# Altium schematic sheet schematics.schdoc
size 551 x 460 mm
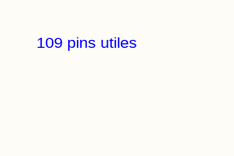
[diagram p0: schematics.schdoc, top left]
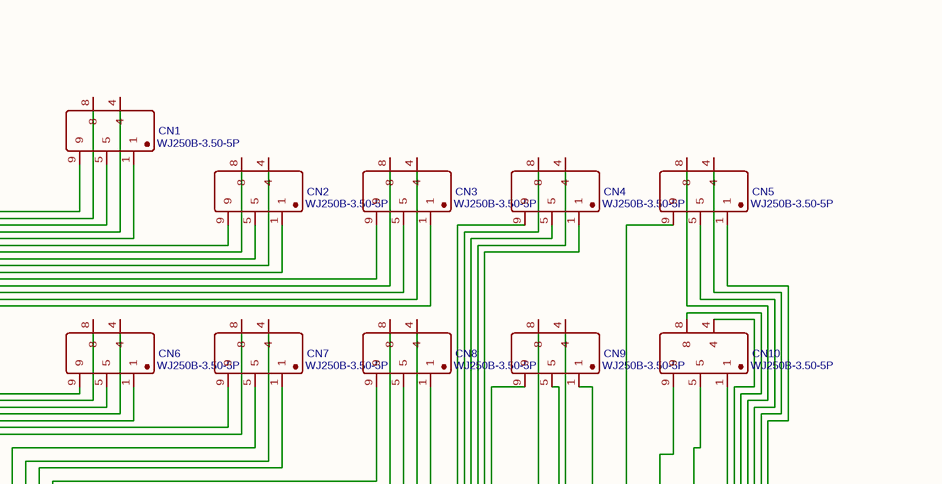
[diagram p1: schematics.schdoc, top right]
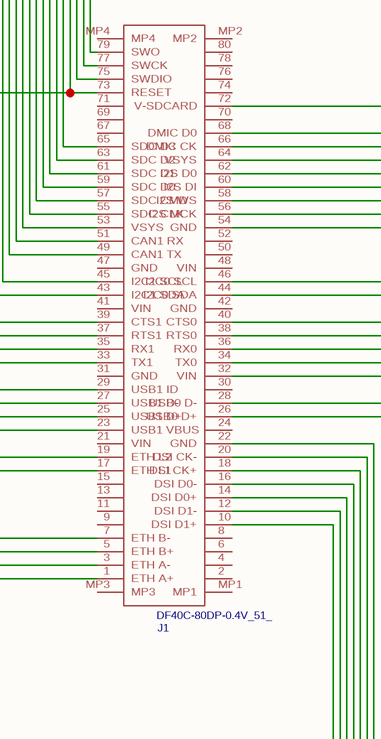
[diagram p2: schematics.schdoc, bottom left]
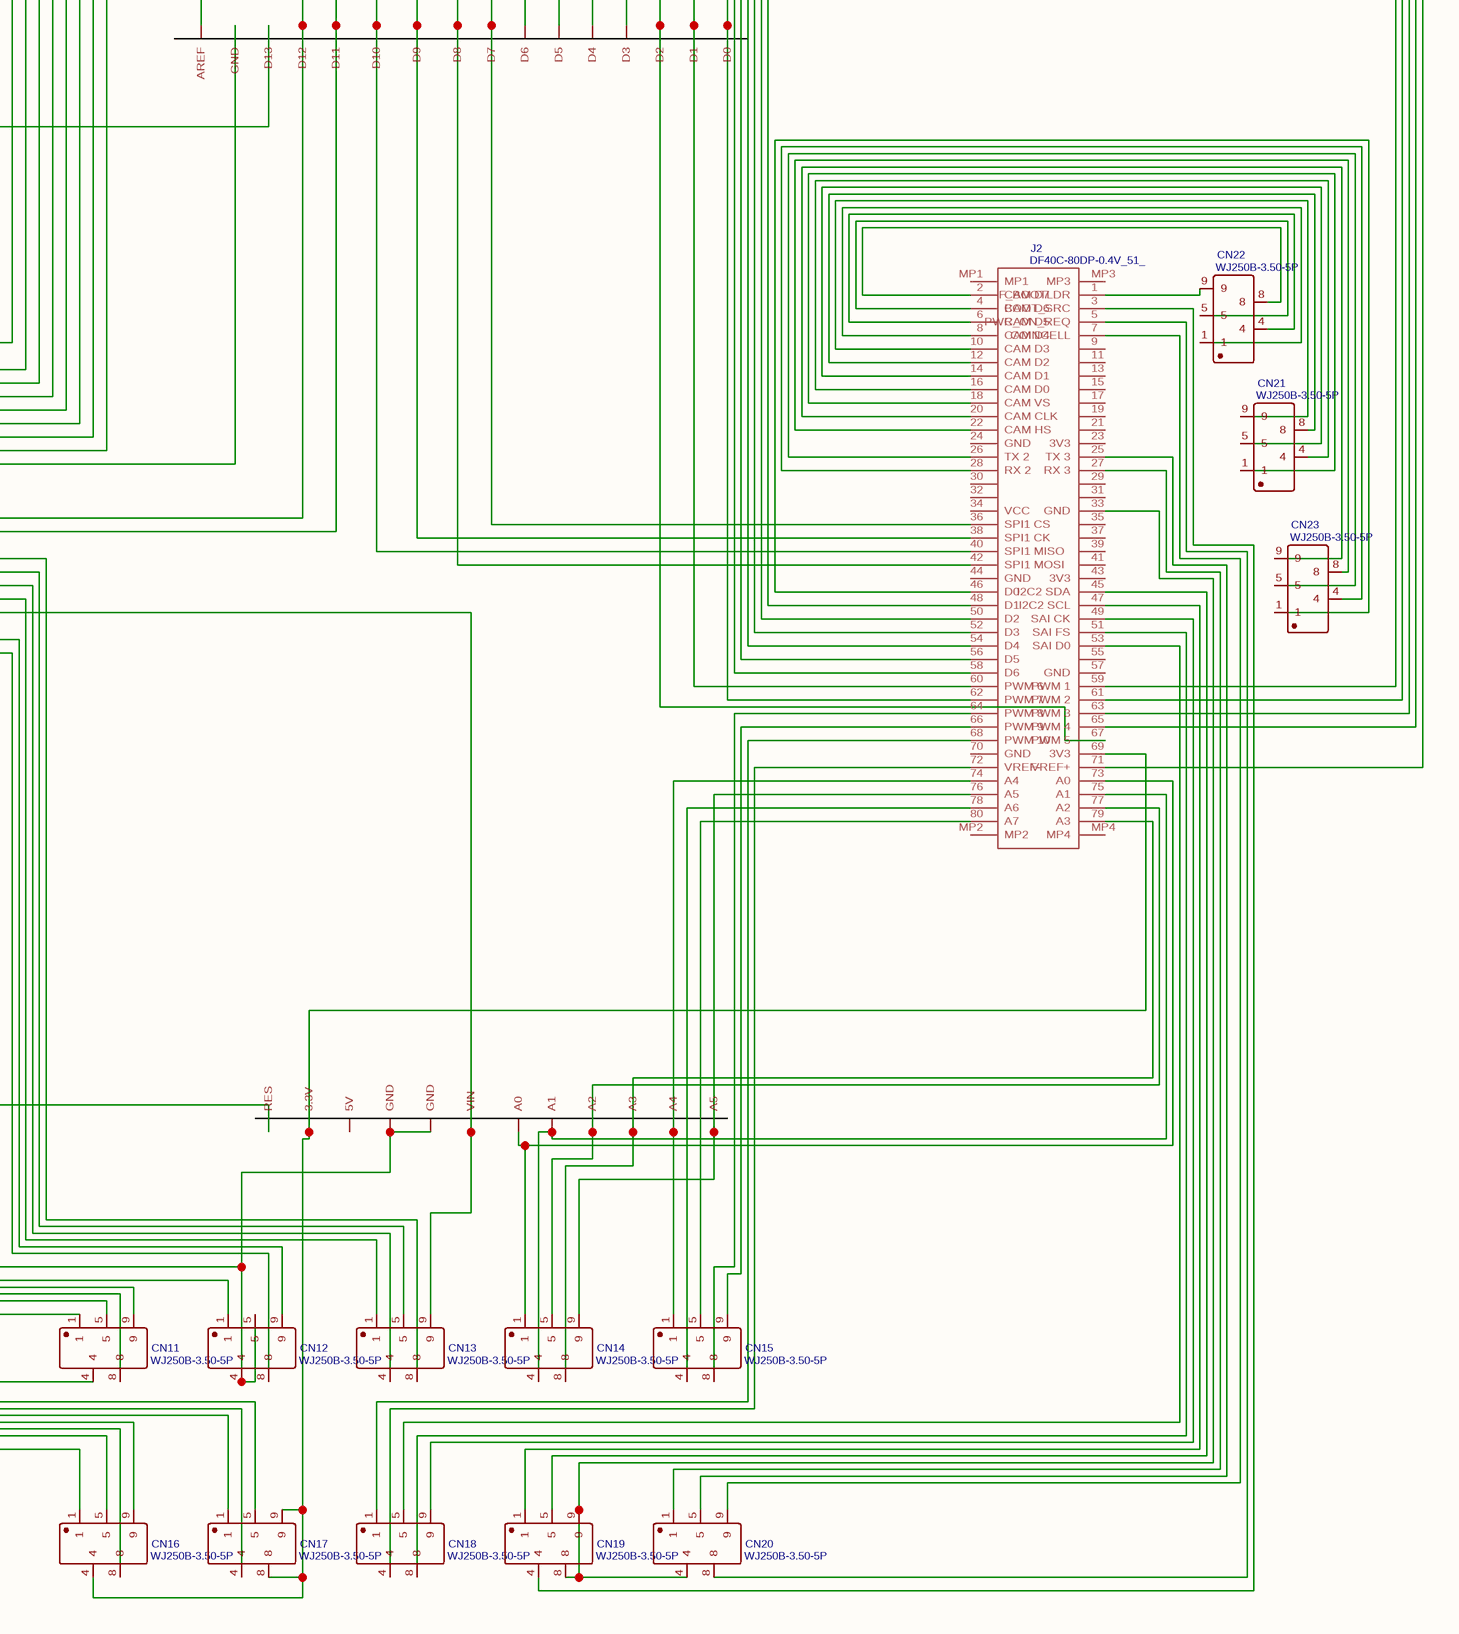
[diagram p3: schematics.schdoc, bottom right]

## Parts
CN1  WJ250B-3.50-5P  [WJ250B-3.50-5P]
CN2  WJ250B-3.50-5P  [WJ250B-3.50-5P]
CN3  WJ250B-3.50-5P  [WJ250B-3.50-5P]
CN4  WJ250B-3.50-5P  [WJ250B-3.50-5P]
CN5  WJ250B-3.50-5P  [WJ250B-3.50-5P]
CN6  WJ250B-3.50-5P  [WJ250B-3.50-5P]
CN7  WJ250B-3.50-5P  [WJ250B-3.50-5P]
CN8  WJ250B-3.50-5P  [WJ250B-3.50-5P]
CN9  WJ250B-3.50-5P  [WJ250B-3.50-5P]
CN10  WJ250B-3.50-5P  [WJ250B-3.50-5P]
CN11  WJ250B-3.50-5P  [WJ250B-3.50-5P]
CN12  WJ250B-3.50-5P  [WJ250B-3.50-5P]
CN13  WJ250B-3.50-5P  [WJ250B-3.50-5P]
CN14  WJ250B-3.50-5P  [WJ250B-3.50-5P]
CN15  WJ250B-3.50-5P  [WJ250B-3.50-5P]
CN16  WJ250B-3.50-5P  [WJ250B-3.50-5P]
CN17  WJ250B-3.50-5P  [WJ250B-3.50-5P]
CN18  WJ250B-3.50-5P  [WJ250B-3.50-5P]
CN19  WJ250B-3.50-5P  [WJ250B-3.50-5P]
CN20  WJ250B-3.50-5P  [WJ250B-3.50-5P]
CN21  WJ250B-3.50-5P  [WJ250B-3.50-5P]
CN22  WJ250B-3.50-5P  [WJ250B-3.50-5P]
CN23  WJ250B-3.50-5P  [WJ250B-3.50-5P]
J1  DF40C-80DP-0.4V_51_  [DF40C80DP04V51]
J2  DF40C-80DP-0.4V_51_  [DF40C80DP04V51]
U1  ARDUINO_SHIELDNO_SILK BIG  [DUEMILANOVE_VIAS]  (value not drawn)

## Nets
NetCN1_1: CN1.1 J1.35(RX1) U1.D13
NetCN1_4: CN1.4 J1.33(TX1)
NetCN1_5: CN1.5 J1.29(USB1_ID)
NetCN1_8: CN1.8 J1.27(USB1_D-)
NetCN1_9: CN1.9 J1.25(USB1_D+)
NetCN2_1: CN2.1 J1.49(CAN1_TX)
NetCN2_4: CN2.4 J1.45(I2C1_SCL)
NetCN2_5: CN2.5 J1.43(I2C1_SDA)
NetCN2_8: CN2.8 J1.39(CTS1)
NetCN2_9: CN2.9 J1.37(RTS1)
NetCN3_1: CN3.1 J1.59(SDC_D0)
NetCN3_4: CN3.4 J1.57(SDC_CMD)
NetCN3_5: CN3.5 J1.55(SDC_CLK)
NetCN3_8: CN3.8 J1.53(VSYS)
NetCN3_9: CN3.9 J1.51(CAN1_RX)
NetCN4_1: CN4.1 J2.42(SPI1_MOSI) U1.D8
NetCN4_4: CN4.4 J2.38(SPI1_CK) U1.D9
NetCN4_5: CN4.5 J2.40(SPI1_MISO) U1.D10
NetCN4_8: CN4.8 J1.44(I2C0_SDA) U1.D11
NetCN4_9: CN4.9 J1.46(I2C0_SCL) U1.D12
NetCN5_1: CN5.1 J2.48(D1)
NetCN5_4: CN5.4 J2.50(D2)
NetCN5_5: CN5.5 J2.52(D3)
NetCN5_8: CN5.8 J2.54(D4)
NetCN5_9: CN5.9 J2.65(PWM_4) U1.D3
NetCN6_1: CN6.1 J1.75(SWDIO)
NetCN6_4: CN6.4 J1.73(RESET) U1.RES
NetCN6_5: CN6.5 J1.65(SDC_D3)
NetCN6_8: CN6.8 J1.63(SDC_D2)
NetCN6_9: CN6.9 J1.61(SDC_D1)
NetCN7_1: CN7.1 J1.66(DMIC_CK)
NetCN7_4: CN7.4 J1.68(DMIC_D0)
NetCN7_5: CN7.5 J1.72(V-SDCARD)
NetCN7_8: CN7.8 J1.79(SWO)
NetCN7_9: CN7.9 J1.77(SWCK)
NetCN8_1: CN8.1 J1.56(I2S_MCK)
NetCN8_4: CN8.4 J1.58(I2S_WS)
NetCN8_5: CN8.5 J1.60(I2S_DI)
NetCN8_8: CN8.8 J1.62(I2S_D0)
NetCN8_9: CN8.9 J1.64(VSYS)
NetCN9_1: CN9.1 J2.63(PWM_3) U1.D4
NetCN9_4: CN9.4 J2.71(VREF+) U1.AREF
NetCN9_5: CN9.5 J2.61(PWM_2) U1.D5
NetCN9_8: CN9.8 J2.59(PWM_1) U1.D6
NetCN9_9: CN9.9 J2.36(SPI1_CS) U1.D7
NetCN10_1: CN10.1 J2.62(PWM_7) U1.RX(D0)
NetCN10_4: CN10.4 J2.58(D6)
NetCN10_5: CN10.5 J2.60(PWM_6) U1.TX(D1)
NetCN10_8: CN10.8 J2.56(D5)
NetCN10_9: CN10.9 J2.67(PWM_5) U1.D2
NetCN11_1: CN11.1 J1.12(DSI_D1-)
NetCN11_4: CN11.4 J1.10(DSI_D1+)
NetCN11_5: CN11.5 J1.14(DSI_D0+)
NetCN11_8: CN11.8 J1.16(DSI_D0-)
NetCN11_9: CN11.9 J1.18(DSI_CK+)
NetCN12_1: CN12.1 J1.20(DSI_CK-)
NetCN12_4: CN12.4 CN12.5 J1.22(GND) U1.GND@0(GND) U1.GND@1(GND)
NetCN12_8: CN12.8 J1.26(USB0_D+)
NetCN12_9: CN12.9 J1.28(USB0_D-)
NetCN13_1: CN13.1 J1.34(TX0)
NetCN13_4: CN13.4 J1.36(RX0)
NetCN13_5: CN13.5 J1.38(RTS0)
NetCN13_8: CN13.8 J1.40(CTS0)
NetCN13_9: CN13.9 J1.32(VIN) U1.VIN
NetCN14_1: CN14.1 J2.73(A0) U1.A0
NetCN14_4: CN14.4 J2.75(A1) U1.A1
NetCN14_5: CN14.5 J2.77(A2) U1.A2
NetCN14_8: CN14.8 J2.79(A3) U1.A3
NetCN14_9: CN14.9 CN15.1 J2.74(A4) J2.76(A5) U1.A4 U1.A5
NetCN15_4: CN15.4 J2.78(A6)
NetCN15_5: CN15.5 J2.80(A7)
NetCN15_8: CN15.8 J2.64(PWM_8)
NetCN15_9: CN15.9 J2.66(PWM_9)
NetCN16_1: CN16.1 J1.23(USB1_VBUS)
NetCN16_4: CN16.4 CN17.8 CN17.9 J2.69(3V3) U1.3.3V
NetCN16_5: CN16.5 J1.19(ETH_L2)
NetCN16_8: CN16.8 J1.17(ETH_L1)
NetCN16_9: CN16.9 J1.7(ETH_B-)
NetCN17_1: CN17.1 J1.5(ETH_B+)
NetCN17_4: CN17.4 J1.3(ETH_A-)
NetCN17_5: CN17.5 J1.1(ETH_A+)
NetCN18_1: CN18.1 J2.68(PWM_10)
NetCN18_4: CN18.4 J2.72(VREF-)
NetCN18_5: CN18.5 J2.53(SAI_D0)
NetCN18_8: CN18.8 J2.51(SAI_FS)
NetCN18_9: CN18.9 J2.49(SAI_CK)
NetCN19_1: CN19.1 J2.47(I2C2_SCL)
NetCN19_4: CN19.4 J2.3(BOOT_SRC)
NetCN19_5: CN19.5 J2.45(I2C2_SDA)
NetCN19_8: CN19.8 CN19.9 CN20.4 J2.33(GND)
NetCN20_1: CN20.1 J2.27(RX_3)
NetCN20_5: CN20.5 J2.25(TX_3)
NetCN20_8: CN20.8 J2.5(PWR_ON_REQ)
NetCN20_9: CN20.9 J2.7(COINCELL)
NetCN21_1: CN21.1 J2.18(CAM_VS)
NetCN21_4: CN21.4 J2.16(CAM_D0)
NetCN21_5: CN21.5 J2.14(CAM_D1)
NetCN21_8: CN21.8 J2.12(CAM_D2)
NetCN21_9: CN21.9 J2.10(CAM_D3)
NetCN22_1: CN22.1 J2.8(CAM_D4)
NetCN22_4: CN22.4 J2.6(CAM_D5)
NetCN22_5: CN22.5 J2.4(CAM_D6)
NetCN22_8: CN22.8 J2.2(CAM_D7)
NetCN22_9: CN22.9 J2.1(F_BOOTLDR)
NetCN23_1: CN23.1 J2.46(D0)
NetCN23_4: CN23.4 J2.28(RX_2)
NetCN23_5: CN23.5 J2.26(TX_2)
NetCN23_8: CN23.8 J2.22(CAM_HS)
NetCN23_9: CN23.9 J2.20(CAM_CLK)
NetJ1_54: J1.54(GND) U1.GND@2(GND)

Not connected (* = marked no-connect by the designer): J1 2 4 6 8 9 11 13 15 21(VIN) 24 30 31(GND) 41(VIN) 42(GND) 47(GND) 48(VIN) 50 52 67 69 70 71 74 76 78 80 MP1 MP2 MP3 MP4; J2 9 11 13 15 17 19 21 23(3V3) 24(GND) 29 30 31 32 34(VCC) 35 37 39 41 43(3V3) 44(GND) 55 57(GND) 70(GND) MP1 MP2 MP3 MP4; U1 5V

## Notes on the sheet
- 109 pins utiles

## Library data of the parts
CN1-CN23 = WJ250B-3.50-5P: BOM_Manufacturer: ReliaPro; BOM_Supplier: LCSC; BOM_Manufacturer Part: WJ250B-3.50-5P; image: //image.lceda.cn/szlcsc/C8453.jpg; BOM_Supplier Part: C8453; spicePre: C; spiceSymbolName: WJ250B-3.50-5P
U1 = ARDUINO_SHIELDNO_SILK BIG: description: Arduino shield footprint; Contributor: SparkFun; spicePre: U; spiceSymbolName: ARDUINO_SHIELDNO_SILK BIG
J1 J2 = DF40C-80DP-0.4V_51_: spicePre: J; spiceSymbolName: DF40C-80DP-0.4V_51_